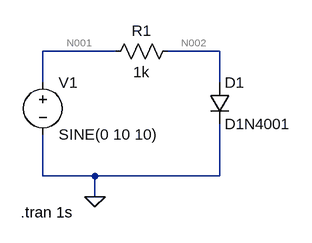
[diagram p0: schematic circuit1.asc]
circuit1.asc, the LTspice schematic file:
Version 4
SHEET 1 880 680
WIRE 128 80 16 80
WIRE 288 80 208 80
WIRE 16 128 16 80
WIRE 288 128 288 80
WIRE 16 272 16 208
WIRE 96 272 16 272
WIRE 288 272 288 192
WIRE 288 272 96 272
WIRE 96 304 96 272
FLAG 96 304 0
SYMBOL res 224 64 R90
WINDOW 0 0 56 VBottom 2
WINDOW 3 32 56 VTop 2
SYMATTR InstName R1
SYMATTR Value 1k
SYMBOL diode 272 128 R0
SYMATTR InstName D1
SYMATTR Value D1N4001
SYMBOL voltage 16 112 R0
WINDOW 123 0 0 Left 0
WINDOW 39 0 0 Left 0
SYMATTR InstName V1
SYMATTR Value SINE(0 10 10)
TEXT -18 328 Left 2 !.tran 1s

The netlist it stands for:
* circuit1.asc
R1 N002 N001 1k
D1 N002 0 D1N4001
V1 N001 0 SINE(0 10 10)
.model D D
.lib standard.dio
.tran 1s
.backanno
.end

* Results of the author's LTspice run, read from the files saved beside the schematic
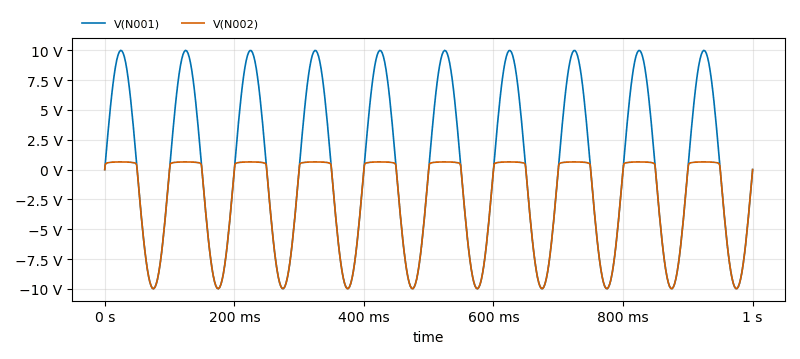
[diagram p1: Transient Analysis of circuit1.asc, plotted from the saved traces]
* Transient Analysis, 1 run:
*   V(N001): min -9.998 V, max 9.998 V, average 127.2 µV, rms 7.069 V, last 0 V
*   V(N002): min -9.989 V, max 642.8 mV, average -2.879 V, rms 5.013 V, last -44.9 µV